# EAGLE design Pi_grammer_ADAPTER (EAGLE 7.6.0)
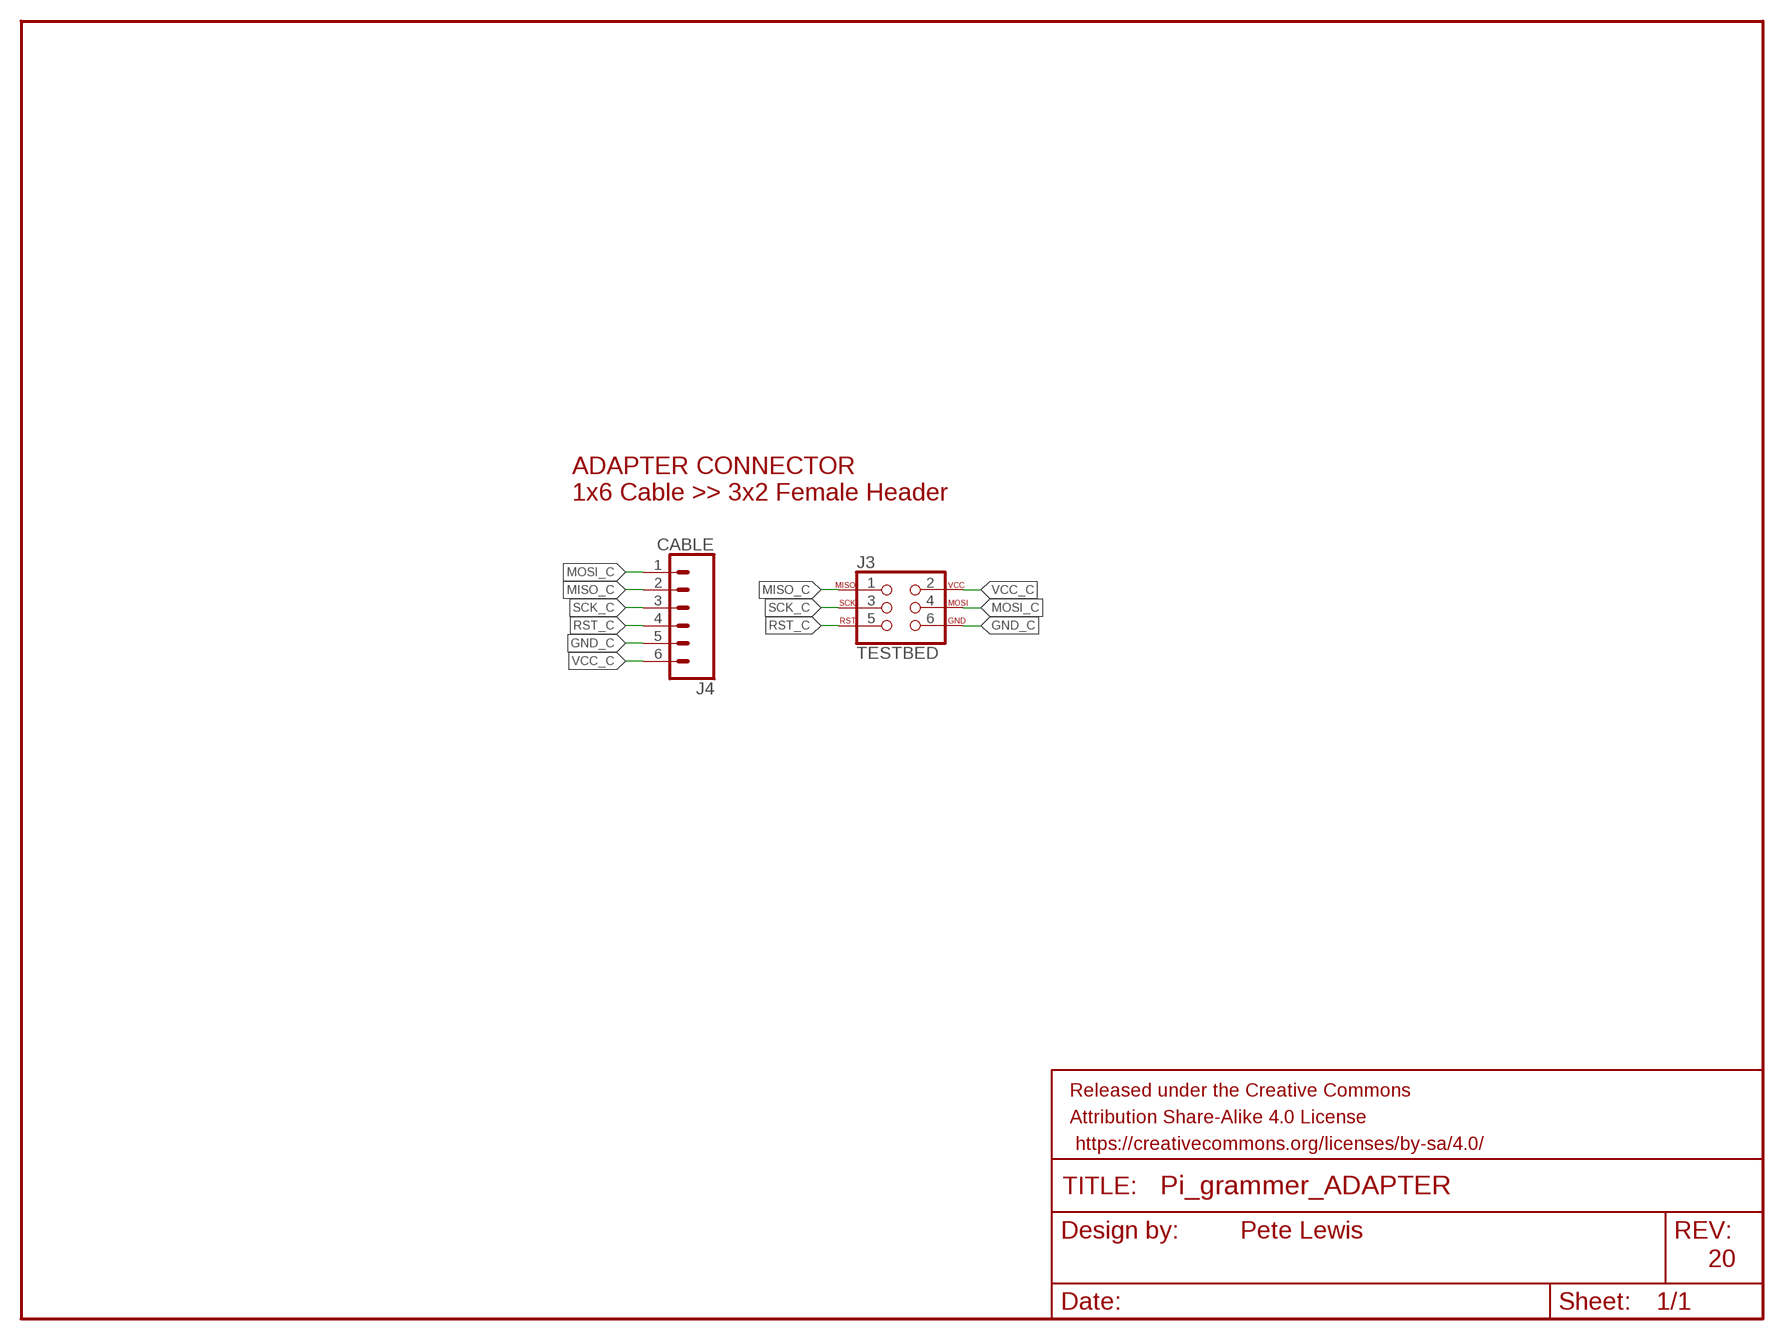
[diagram p0: schematic, sheet 1]

## Parts
FRAME1  FRAME-LETTER  [CREATIVE_COMMONS]
J3  TESTBED  AVR_SPI_PROG_3X22X3_LOCK  [2X3_LOCK]
J4  CABLE  CONN_06RA_LOCK  [MOLEX_1X6_RA_LOCK]

## Nets
GND_C: J3.6 J4.5
MISO_C: J3.1 J4.2
MOSI_C: J3.4 J4.1
RST_C: J3.5 J4.4
SCK_C: J3.3 J4.3
VCC_C: J3.2 J4.6

## Notes on the sheet
- ADAPTER CONNECTOR
  1x6 Cable >> 3x2 Female Header
- Pete Lewis
- 20

## Library data of the parts
FRAME1 = SparkFun-Aesthetics:FRAME-LETTER: Schematic Frame - Letter Standard 8.5x11 US Letter frame
J3 = SparkFun-Connectors:AVR_SPI_PROG_3X2: AVR ISP 6 Pin This is the reduced ISP connector for AVR programming. Common on Arduino. This footprint will take up less PCB space and can be used with a 10-pin to 6-pin adapter such as SKU: BOB-08508 **Special note about "TEST_POINT" package. The stop mask is on the top side, so if you want your programming test points to be on the bottom of your board, make sure to place this package on the bottom side of the board. This also ensure that the orientation to program from the bottom side will be correct.; PROD_ID: CONN-11566
J4 = SparkFun-Connectors:CONN_06: Header 6 Standard 6-pin 0.1" header. Use with straight break away headers (SKU : PRT-00116), right angle break away headers (PRT-00553), swiss pins (PRT-00743), machine pins (PRT-00117), and female headers (PRT-00115). Molex polarized connector foot print use with SKU : PRT-08094 with associated crimp pins and housings. NOTES ON THE VARIANTS LOCK and LOCK_LONGPADS... This footprint was designed to help hold the alignment of a through-hole component (i.e. 6-pin header) while soldering it into place. You may notice that each hole has been shifted either up or down by 0.005 of an inch from it's more standard position (which is a perfectly straight line). This slight alteration caused the pins (the squares in the middle) to touch the edges of the holes. Because they are alternating, it causes a "brace" to hold the component in place. 0.005 has proven to be the perfect amount of "off-center" position when using our standard breakaway headers. Although looks a little odd when you look at the bare footprint, once you have a header in there, the alteration is very hard to notice. Also,if you push a header all the way into place, it is covered up entirely on the bottom side. This idea of altering the position of holes to aid alignment will be further integrated into the Sparkfun Library for other footprints. It can help hold any component with 3 or more connection pins.; PROD_ID: CONN-10140

## Board
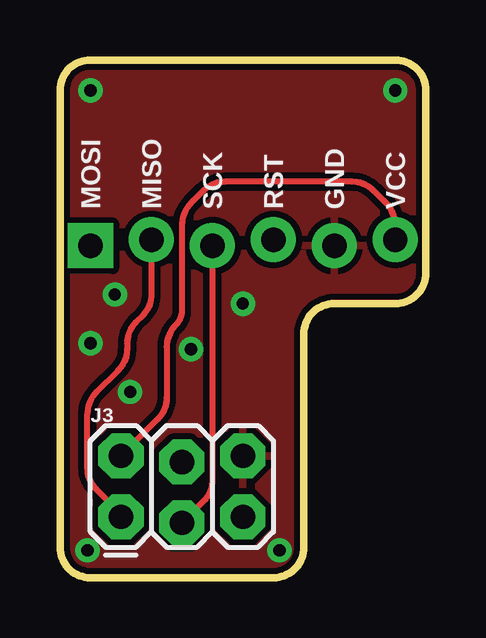
[diagram p1: board, top side]
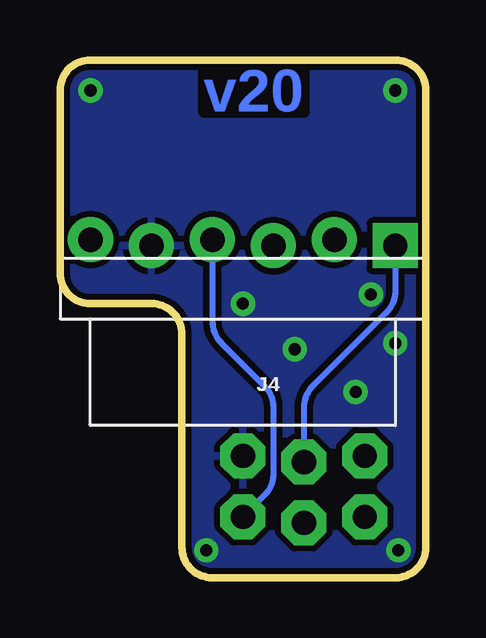
[diagram p2: board, bottom side, seen from below]

Size 15.24 x 21.59 mm. Coordinates in mm from the lower left corner, seen from the top.
Outline: 10.16,1.27 arc-90 8.89,0 1.27,0 arc-90 0,1.27 0,20.32 arc-90 1.27,21.59 13.97,21.59 arc-90 15.24,20.32 15.24,12.7 arc-90 13.97,11.43 11.43,11.43 arc90 10.16,10.16 10.16,1.27
Copper layers (1*16): Top 0.035mm / dielectric 1.5mm / Bottom 0.035mm
Design rules "SparkFun-2-layer-STANDARD": minimum track width 10mil, minimum drill 20mil, track to track 10mil, track to pad 8mil, pad to pad 8mil, via to via 10mil, smd to smd 8mil, copper to edge 8mil, drill to drill 8mil, minimum pad ring 10mil, minimum via ring 10mil, stop-mask expansion 4mil, vias tented up to drill 25mil, thermal gap 10mil

### Footprints (pad centres in the part's own frame; a part is rotated, then mirrored left to right if it is on the bottom)
2X3_LOCK = drill 1.016 pad 1.88 octagon: 1 0,0; 2 0,2.54; 3 2.54,-0.254; 4 2.54,2.286; 5 5.08,0; 6 5.08,2.54
MOLEX_1X6_RA_LOCK = drill 1.016 pad 1.88 square: 1 0,0.127 | drill 1.016 pad 1.88: 2 2.54,-0.127; 3 5.08,0.127; 4 7.62,-0.127; 5 10.16,0.127; 6 12.7,-0.127

### Placement (x,y rotation side)
FRAME1  -21.59,-12.7 0 top  (outside the outline)
J3  2.54,2.54 0 top
J4  1.27,13.97 180 bottom

### Tracks (layer width: path | path; a pad name or v marks a point on that pad's centre or on a via)
GND_C  (via drill 0.51)
  other vias: 7.62,11.43 2.29,11.81 1.27,9.78 2.92,7.75 1.14,1.14 9.14,1.14 1.27,20.32 13.97,20.32 5.46,9.53
  pour Bottom (isolate 0.254): 15.24,0 0,0 0,21.59 15.24,21.59
  pour Top (isolate 0.254): 15.24,0 0,0 0,21.59 15.24,21.59
MISO_C
  Top 0.254: J4.2 3.81,11.83 arc-45 3.44,10.93 3.17,10.66 arc45 2.79,9.76 2.79,9.54 arc-45 2.42,8.64 1.51,7.74 arc45 1.14,6.84 1.14,4.59 arc45 1.51,3.69 2.54,2.67 J3.1
MOSI_C
  Bottom 0.254: J4.1 1.27,11.96 arc45 1.64,11.06 4.71,7.99 arc-45 5.08,7.09 J3.4
RST_C
  Bottom 0.254: J4.4 8.89,10.69 arc-45 8.52,9.79 6.72,7.99 arc45 6.35,7.09 6.35,4.34 arc45 6.72,3.44 J3.5
SCK_C
  Top 0.254: J4.3 6.35,4.08 arc-45 5.98,3.18 J3.3
VCC_C
  Top 0.254: J4.6 13.97,14.71 arc45 13.6,15.61 13.07,16.14 arc45 12.17,16.51 6.88,16.51 arc45 5.98,16.14 5.45,15.61 arc45 5.08,14.71 5.08,11.17 arc-45 4.82,10.53 arc45 4.45,9.63 4.45,7.51 arc-45 4.07,6.61 J3.2

### Text on the board
Bottom: v20
tPlace: MOSI | MISO | SCK | RST | GND | VCC
tDocu: Pete Lewis